# Altium schematic sheet H_Bridge1.SchDoc
size A4 portrait; SheetNumber: 1; SheetTotal: 1
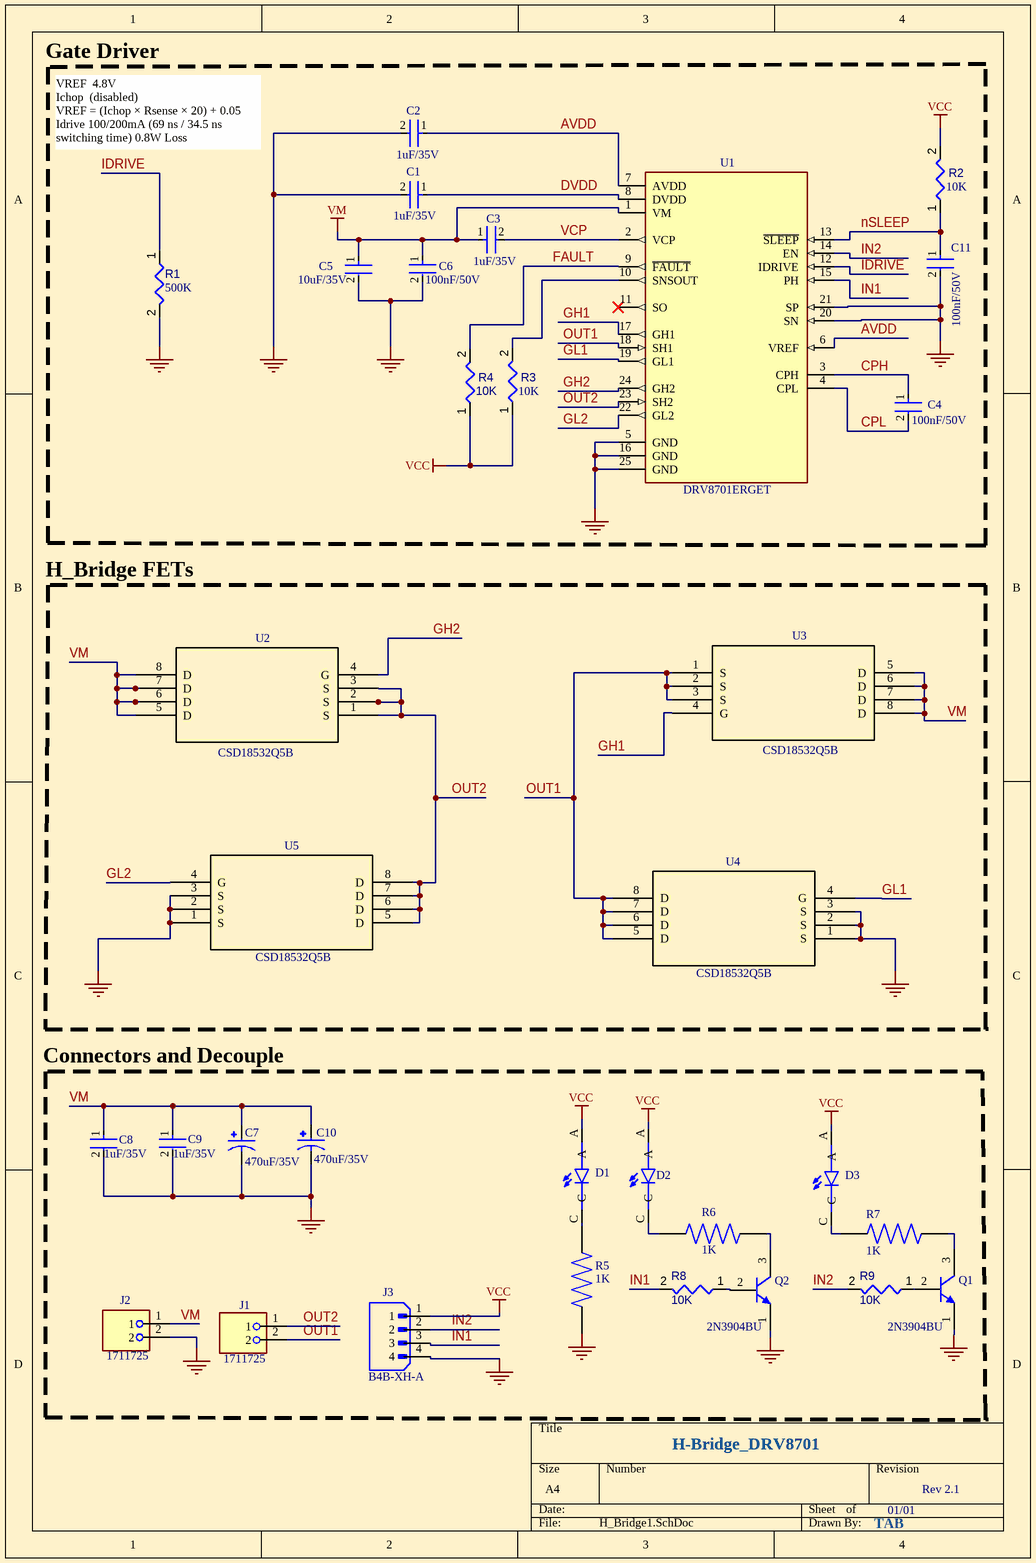
[diagram p0: H_Bridge1.SchDoc]

## Parts
C1  1uF/35V  [FP-ECHUH3-MFG]
C2  1uF/35V  [FP-ECHUH3-MFG]
C3  1uF/35V  [FP-ECHUH3-MFG]
C4  100nF/50V  [FP-CC0805-0_85-MFG]
C5  10uF/35V  [FP-ECHUH3-MFG]
C6  100nF/50V  [FP-CC0805-0_85-MFG]
C7  470uF/35V  [CAPPRD500W80D1000H1170]
C8  1uF/35V  [FP-ECHUH3-MFG]
C9  1uF/35V  [FP-ECHUH3-MFG]
C10  470uF/35V  [CAPPRD500W80D1000H1170]
C11  100nF/50V  [FP-CC0805-0_85-MFG]
D1  WP7113ID  [LED_WP7113ID]  (value not drawn)
D2  WP7113ID  [LED_WP7113ID]  (value not drawn)
D3  WP7113ID  [LED_WP7113ID]  (value not drawn)
J1  1711725  [PHOENIX_1711725]
J2  1711725  [PHOENIX_1711725]
J3  B4B-XH-A  [JST_B4B-XH-A]
Q1  2N3904BU  [FAIR-TO-92]
Q2  2N3904BU  [FAIR-TO-92]
R1  value 500K  [RESC3216X60X45ML15T20]  (hidden comment: 33K)
R2  10K  [RESC3216X60X45ML15T20]
R3  10K  [RESC3216X60X45ML15T20]
R4  10K  [RESC3216X60X45ML15T20]
R5  1K  [RES_ERA6AED822V]
R6  1K  [RES_ERA6AED822V]
R7  1K  [RES_ERA6AED822V]
R8  10K  [RESC3216X60X45ML15T20]
R9  10K  [RESC3216X60X45ML15T20]
U1  DRV8701ERGET  [QFN50P400X400X100-25N]
U2  CSD18532Q5B  [DNK8]
U3  CSD18532Q5B  [DNK8]
U4  CSD18532Q5B  [DNK8]
U5  CSD18532Q5B  [DNK8]

## Blocks framed on the sheet
Gate Driver: C1-C6 C11 R1-R4 U1
H_Bridge FETs: U2-U5
Connectors and Decouple: C7-C10 D1-D3 J1-J3 Q1 Q2 R5-R9

## Nets
GND: C1.2 C2.2 C5.2 C6.2 C7.N C8.2 C9.2 C10.N C11.2 J2.2 J3.4 Q1.1(E) Q2.1(E) R1.2 R5.1 U1.5(GND) U1.16(GND) U1.20(SN) U1.21(SP) U1.25(GND) U4.1(S) U4.2(S) U4.3(S) U5.1(S) U5.2(S) U5.3(S)
VCC: D1.A D2.A D3.A J3.1 R2.2 R3.1 R4.1
VM: C3.1 C5.1 C6.1 C7.P C8.1 C9.1 C10.P J2.1 U1.1(VM) U2.5(D) U2.6(D) U2.7(D) U2.8(D) U3.5(D) U3.6(D) U3.7(D) U3.8(D)
AVDD: C2.1 U1.6(VREF) U1.7(AVDD)
CPL: C4.2 U1.4(CPL)
DVDD: C1.1 U1.8(DVDD)
FAULT: R4.2 U1.9(~{FAULT})
GH1: U1.17(GH1) U3.4(G)
GH2: U1.24(GH2) U2.4(G)
GL1: U1.19(GL1) U4.4(G)
GL2: U1.22(GL2) U5.4(G)
IDRIVE: R1.1 U1.12(IDRIVE)
IN1: J3.3 R8.2 U1.15(PH)
IN2: J3.2 R9.2 U1.14(EN)
nSLEEP: C11.1 R2.1 U1.13(~{SLEEP})
OUT1: J1.2 U1.18(SH1) U3.1(S) U3.2(S) U3.3(S) U4.5(D) U4.6(D) U4.7(D) U4.8(D)
OUT2: J1.1 U1.23(SH2) U2.1(S) U2.2(S) U2.3(S) U5.5(D) U5.6(D) U5.7(D) U5.8(D)
VCP: C3.2 U1.2(VCP)
NetC4_1: C4.1 U1.3(CPH)
NetD1_C: D1.C R5.2
NetD2_C: D2.C R6.2
NetD3_C: D3.C R7.1
NetQ1_2: Q1.2(B) R9.1
NetQ1_3: Q1.3(C) R7.2
NetQ2_2: Q2.2(B) R8.1
NetQ2_3: Q2.3(C) R6.1
NetR3_2: R3.2 U1.10(SNSOUT)

Not connected (* = marked no-connect by the designer): U1 11(SO)*

## Notes on the sheet
- VREF  4.8V
  Ichop  (disabled)
  VREF = (Ichop × Rsense × 20) + 0.05
  Idrive 100/200mA (69 ns / 34.5 ns switching time) 0.8W Loss
- H-Bridge_DRV8701
- TAB
- 01/01
- Rev 2.1
- Labels drawn without touching a wire or pin: CPH

## Library data of the parts
C1 C3 C8 C9 = CMP-05434-000006-1: 1uF/35V MLCC; Voltage: 16V; Insulation Resistance: 3GR; Dielectric Material: Polyphenylene; Capacitance: 47nF; Tolerance: 2%; Dielectric: PPS; Life (Hours): 500Hour; Depth: 1.6mm; Packaging: Tape and Reel; Case Code (Imperial): 1206; Contact Plating: Copper; Series: ECHU(X); Voltage Rating (DC): 16V; Package Quantity: 2000; Voltage Rating: 16V; Length: 3.2mm; Construction: Flat; Weight: 0.000353oz; Max Operating Temperature: 125°C; RoHS Compliant: Yes; Min Operating Temperature: -55°C; Height - Seated (Max): 0.067inch; Width: 0.063inch; Radiation Hardening: No; Lead Free: Lead Free; Case/Package: 1206; REACH SVHC: No SVHC; Case Code (Metric): 3216; Height: 1.5mm; Mount: Surface Mount; Termination: SMD/SMT
C2 = CMP-05434-000006-1: 1uF/35V MLCC; Voltage: 16V; Insulation Resistance: 3GR; Dielectric Material: Polyphenylene; Capacitance: 1uF; Tolerance: 2%; Dielectric: PPS; Life (Hours): 500Hour; Depth: 1.6mm; Packaging: Tape and Reel; Case Code (Imperial): 1206; Contact Plating: Copper; Series: ECHU(X); Voltage Rating (DC): 16V; Package Quantity: 2000; Voltage Rating: 16V; Length: 3.2mm; Construction: Flat; Weight: 0.000353oz; Max Operating Temperature: 125°C; RoHS Compliant: Yes; Min Operating Temperature: -55°C; Height - Seated (Max): 0.067inch; Width: 0.063inch; Radiation Hardening: No; Lead Free: Lead Free; Case/Package: 1206; REACH SVHC: No SVHC; Case Code (Metric): 3216; Height: 1.5mm; Mount: Surface Mount; Termination: SMD/SMT
C4 C6 C11 = CMP-03422-001106-1: 100nF/50V MLCC; Manufacturer Part Number: CC0805MKX7R6BB105; Manufacturer: Yageo; Value: 1 uF; Temperature Characteristic: X7R; Tolerance: 0.2; Voltage Rating: 10 V; Material: Ceramic; Digikey Description: CAP CER 1UF 10V X7R 0805; Device Class L3: Ceramic Capacitors; Automotive: No; Temperature Range Low: -30°C; Temperature: -30°C to +85°C; Octopart: https://octopart.com/cc0805mkx7r6bb105-yageo-71334590; Category: Cap; Footprint Url: http://www.yageo.com/exep/pages/download/literatures/UPY-C_GEN_24.pdf; RoHS: TRUE; Temperature Range High: +85°C; Ipc Land Pattern Name: CAPC200125X85; ComponentLink2URL: http://www.yageo.com/documents/recent/UPY-GPHC_Y5V_6.3V-to-50V_8.pdf; ComponentLink2Description: Datasheet; Device Class L2: Capacitors; Mouser Description: Multilayer Ceramic Capacitors MLCC - SMD/SMT 1.0uF 10V X7R 20%; Package: CC0805-0.85; Lead Free: Yes; Device Class L1: Passive Components; Capacitance: 1 uF; Height: 0.95mm
C5 = CMP-05434-000006-1: 10uF/35V MLCC; Voltage: 16V; Insulation Resistance: 3GR; Dielectric Material: Polyphenylene; Capacitance: 47nF; Tolerance: 2%; Dielectric: PPS; Life (Hours): 500Hour; Depth: 1.6mm; Packaging: Tape and Reel; Case Code (Imperial): 1206; Contact Plating: Copper; Series: ECHU(X); Voltage Rating (DC): 16V; Package Quantity: 2000; Voltage Rating: 16V; Length: 3.2mm; Construction: Flat; Weight: 0.000353oz; Max Operating Temperature: 125°C; RoHS Compliant: Yes; Min Operating Temperature: -55°C; Height - Seated (Max): 0.067inch; Width: 0.063inch; Radiation Hardening: No; Lead Free: Lead Free; Case/Package: 1206; REACH SVHC: No SVHC; Case Code (Metric): 3216; Height: 1.5mm; Mount: Surface Mount; Termination: SMD/SMT
C7 C10 = EEHAZSV471UB: MF: {'manufacturer': u'Panasonic Electronic Components'}; Package: None; Price: None; Value: *; MP: EEHAZSV471UB; Availability: Unavailable
D1-D3 = WP7113ID: Red 617nm LED Indication - Discrete 2V Radial; MF: Kingbright; Price: None; MP: WP7113ID; Package: Radial Kingbright; Check_prices: https://www.snapeda.com/parts/WP7113ID/Kingbright/view-part/?ref=eda; Purchase-URL: https://pricing.snapeda.com/search/part/WP7113ID/?ref=eda; Availability: In Stock; Value: *; SnapEDA_Link: https://www.snapeda.com/parts/WP7113ID/Kingbright/view-part/?ref=snap
J1 J2 = 1711725: PCB Terminal Screw 5.08mm 12AWG 400V 24A 2 Position COMBICON MKDS Series | Phoenix Contact 1711725; SnapEDA_Link: https://www.snapeda.com/parts/1711725/Phoenix+Contact/view-part/?ref=snap; Package: None; Value: *; MF: Phoenix Contact; MP: 1711725; Check_prices: https://www.snapeda.com/parts/1711725/Phoenix+Contact/view-part/?ref=eda
J3 = B4B-XH-A: Connector Header Through Hole 4 position 0.098 (2.50mm); MF: JST Sales; SnapEDA_Link: https://www.snapeda.com/parts/B4B-XH-A/JST/view-part/?ref=snap; Package: None; Value: *; MP: B4B-XH-A; Check_prices: https://www.snapeda.com/parts/B4B-XH-A/JST/view-part/?ref=eda
Q1 Q2 = CMP-2000-04944-1: NPN General-Purpose Amplifier, 40 V VCEO, 0.2 A, -55 to 150 degC, 2-Pin TO-92, RoHS, Bulk; Manufacturer: FairchildSemiconductor; Maximum Collector Base Voltage: 60V; Minimum DC Current Gain: 40@0.1mA@1V; Maximum Collector Emitter Voltage: 40V; Maximum DC Collector Current: 0.2A; Rad Hard: No; Maximum Operating Frequency: 300(Min)MHz; Maximum Collector Emitter Saturation Voltage: 0.2@1mA@10mA; Maximum Power Dissipation: 625mW; Package Description: 3-Pin Transistor Outline Package, Body Dia 4.79 mm, Pitch 1.27 mm; Package Reference: TO-92; Pin Count: 3; Operating Temperature: -55to150degC; Category: GPBJT; Manufacturer URL: https://www.fairchildsemi.com/; Datasheet URL: https://datasheet.ciiva.com/4722/2n3904-82270-4722369.pdf; Package: 3TO-92; Packaging: Bulk; Type: NPN; Datasheet Version: Rev. 1.1.0, 10/2014; Mounting: ThroughHole
R1-R3 = CMP-009-00025-5: Chip Resistor, 100 KOhm, +/- 1%, 0.25 W, -55 to 155 degC, 1206 (3216 Metric); Voltage Rating: 200V; Power: 250mW; RoHS Compliant: True; Max Operating Temperature: 155°C; Pins: 2; Tolerance: 1%; Mounting Technology: SM; Case/Package: 1206; Min Operating Temperature: -55°C
  R2 R3: Value: 10K
R4 R8 R9 = CMP-009-00025-5: 10K 1206; Voltage Rating: 200V; Tolerance: 1%; Power: 250mW; RoHS Compliant: True; Max Operating Temperature: 155°C; Value: 10k; Pins: 2; Mounting Technology: SM; Case/Package: 1206; Min Operating Temperature: -55°C
R5-R7 = ERA6AED822V: Value: *; Availability: Unavailable; MP: ERA6AED822V; Price: None; Package: None
U1 = DRV8701ERGET: 47-V H-bridge smart gate driver; MF: Texas Instruments; Package: QFN-24 Texas Instruments; Purchase-URL: https://pricing.snapeda.com/search/part/DRV8701ERGET/?ref=eda; Value: *; Price: None; Check_prices: https://www.snapeda.com/parts/DRV8701ERGET/Texas+Instruments/view-part/?ref=eda; MP: DRV8701ERGET; SnapEDA_Link: https://www.snapeda.com/parts/DRV8701ERGET/Texas+Instruments/view-part/?ref=snap; Availability: In Stock
U2-U5 = CSD18532Q5B: 60-V, N channel NexFETâ„¢ power MOSFET, single SON 5 mm x 6 mm, 3.2 mOhm 8-VSON-CLIP -55 to 150; Manufacturer_Name: Texas Instruments; Copyright: Copyright (C) 2025 Ultra Librarian. All rights reserved.; Manufacturer_Part_Number: CSD18532Q5B; RefDes: RefDes; Type: Type